# EAGLE design IIITDuino Ver0.5 (EAGLE 9.1.2)
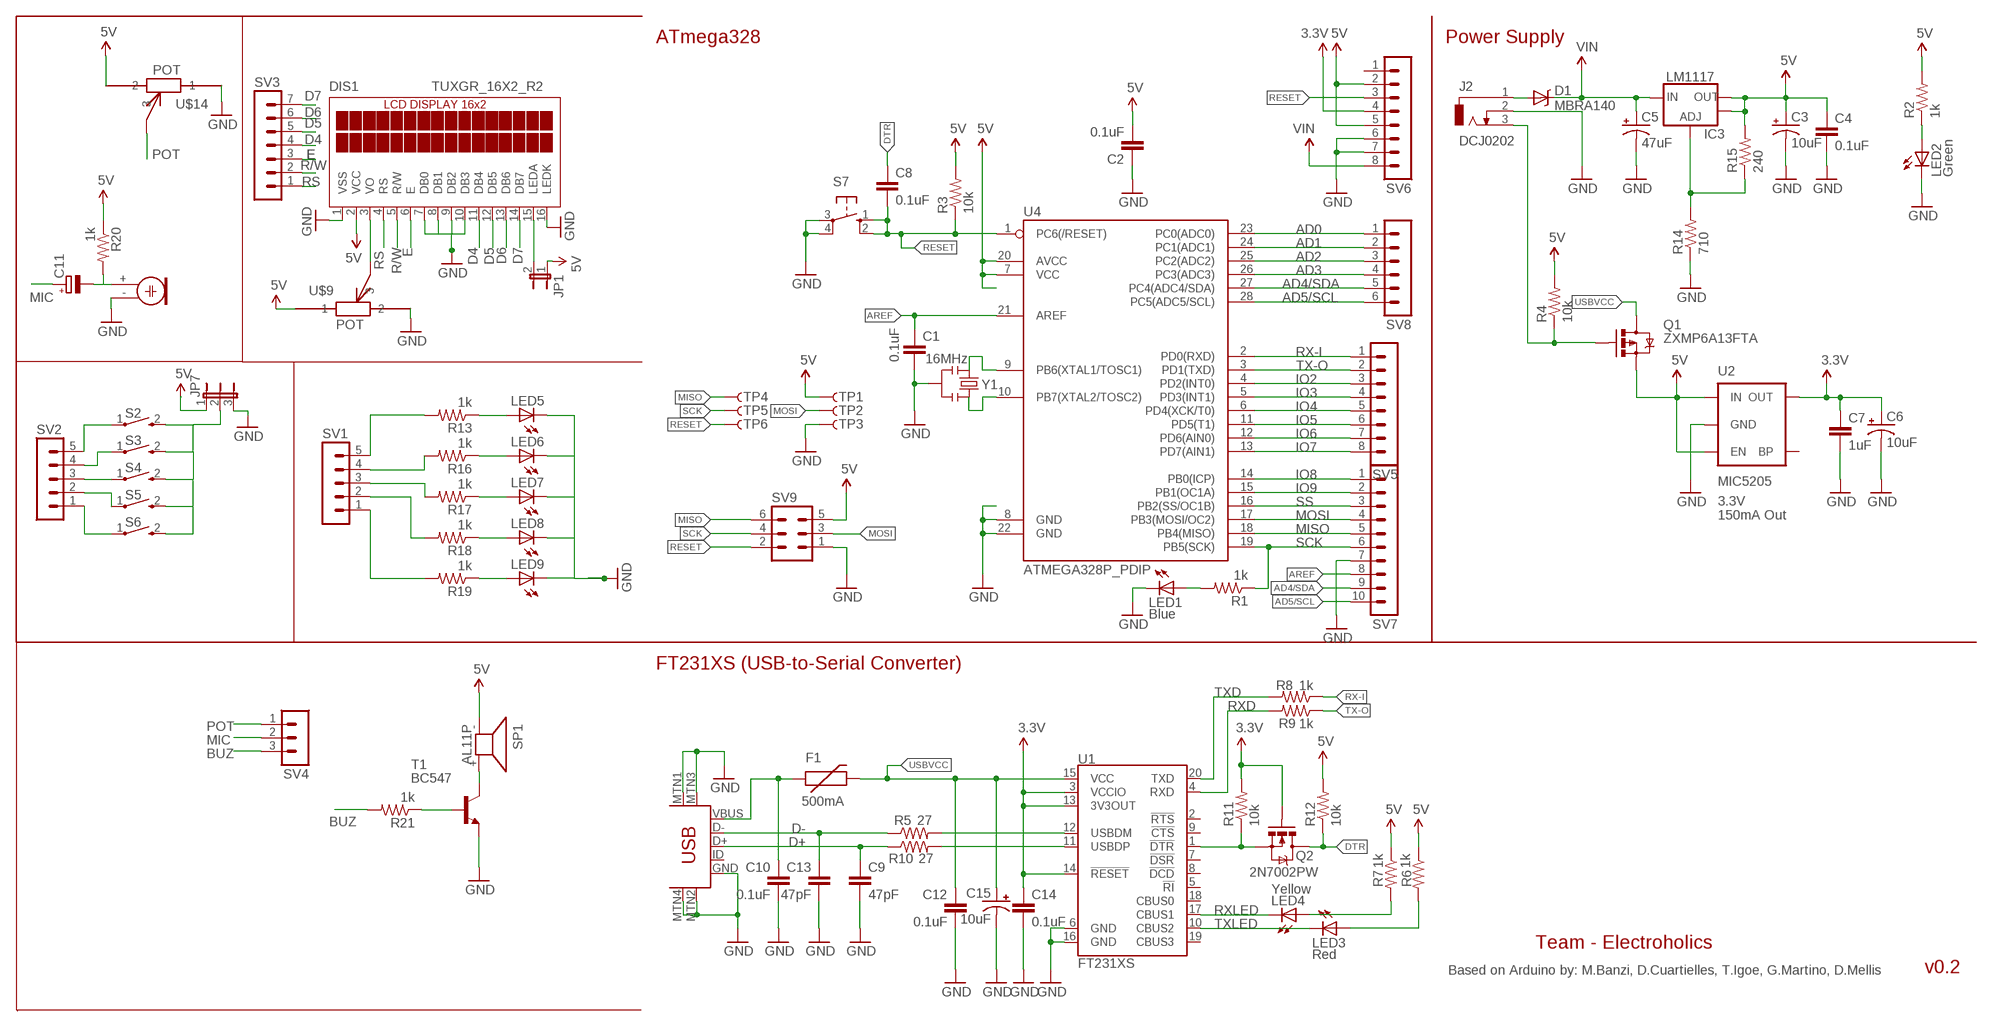
[diagram p0: schematic, sheet 1]

## Parts
C1  0.1uF  CAP0603-CAP  [0603-CAP]
C2  0.1uF  CAP0603-CAP  [0603-CAP]
C3  10uF  CAP_POL1206  [EIA3216]
C4  0.1uF  CAP0603-CAP  [0603-CAP]
C5  47uF  CAP_POLD  [PANASONIC_D]
C6  10uF  CAP_POL1206  [EIA3216]
C7  1uF  CAP0603-CAP  [0603-CAP]
C8  0.1uF  CAP0603-CAP  [0603-CAP]
C9  47pF  47PF-50V-5%(0603)  [0603-CAP]
C10  0.1uF  CAP0603-CAP  [0603-CAP]
C11  CPOL-EUE2.5-5  [E2,5-5]
C12  0.1uF  CAP0603-CAP  [0603-CAP]
C13  47pF  47PF-50V-5%(0603)  [0603-CAP]
C14  0.1uF  CAP0603-CAP  [0603-CAP]
C15  10uF  CAP_POL1206  [EIA3216]
D1  MBRA140  DIODE-SCHOTTKY_  [SMA-DIODE]
DIS1  TUXGR_16X2_R2  [LCD_16X2_PAC]
F1  500mA  PTCSMD  [PTC-1206]
IC3  LM1117  V_REG_LM1117ALT1  [SOT223-ALT1]
J2  DCJ0202  [DCJ0202]
JP1  JP1E  [JP1]
JP7  JP2E  [JP2]
LED1  Blue  LED1206-NS  [LED-1206-NO_SILK]
LED2  Green  LED1206-NS  [LED-1206-NO_SILK]
LED3  Red  LED1206-NS  [LED-1206-NO_SILK]
LED4  Yellow  LED1206-NS  [LED-1206-NO_SILK]
LED5  LEDCHIP-LED0805  [CHIP-LED0805]
LED6  LEDCHIP-LED0805  [CHIP-LED0805]
LED7  LEDCHIP-LED0805  [CHIP-LED0805]
LED8  LEDCHIP-LED0805  [CHIP-LED0805]
LED9  LEDCHIP-LED0805  [CHIP-LED0805]
M1  ELECTRET_MICROPHON-TOM-1545P-R  [TOM-1545P-R]
Q1  ZXMP6A13FTA  MOSFET-PCHANNELSMD  [SOT23-3]
Q2  2N7002PW  MOSFET-NCHANNEL2N7002PW  [SOT323]
R1  1k  RESISTOR0603-RES  [0603-RES]
R2  1k  RESISTOR0603-RES  [0603-RES]
R3  10k  RESISTOR0603-RES  [0603-RES]
R4  10k  RESISTOR0603-RES  [0603-RES]
R5  27  RESISTOR0603-RES  [0603-RES]
R6  1k  RESISTOR0603-RES  [0603-RES]
R7  1k  RESISTOR0603-RES  [0603-RES]
R8  1k  RESISTOR0603-RES  [0603-RES]
R9  1k  RESISTOR0603-RES  [0603-RES]
R10  27  RESISTOR0603-RES  [0603-RES]
R11  10k  RESISTOR0603-RES  [0603-RES]
R12  10k  RESISTOR0603-RES  [0603-RES]
R13  1k  RESISTOR0603-RES  [0603-RES]
R14  710  RESISTOR0603-RES  [0603-RES]
R15  240  RESISTOR0603-RES  [0603-RES]
R16  1k  RESISTOR0603-RES  [0603-RES]
R17  1k  RESISTOR0603-RES  [0603-RES]
R18  1k  RESISTOR0603-RES  [0603-RES]
R19  1k  RESISTOR0603-RES  [0603-RES]
R20  1k  RESISTOR0603-RES  [0603-RES]
R21  1k  RESISTOR0603-RES  [0603-RES]
S2  10-XX  [B3F-10XX]
S3  10-XX  [B3F-10XX]
S4  10-XX  [B3F-10XX]
S5  10-XX  [B3F-10XX]
S6  10-XX  [B3F-10XX]
S7  10-XX  [B3F-10XX]
SP1  AL11P  [AL11P]
SV1  MA05-1  [MA05-1]
SV2  MA05-1  [MA05-1]
SV3  MA07-1  [MA07-1]
SV4  MA03-1  [MA03-1]
SV5  MA08-1  [MA08-1]
SV6  MA08-1  [MA08-1]
SV7  MA10-1  [MA10-1]
SV8  MA06-1  [MA06-1]
SV9  MA03-2  [MA03-2]
T1  BC547  [TO92]
TP1  TP-3x5  TEST-POINT3X5  [PAD.03X.05]
TP2  TP-3x5  TEST-POINT3X5  [PAD.03X.05]
TP3  TP-3x5  TEST-POINT3X5  [PAD.03X.05]
TP4  TP-3x5  TEST-POINT3X5  [PAD.03X.05]
TP5  TP-3x5  TEST-POINT3X5  [PAD.03X.05]
TP6  TP-3x5  TEST-POINT3X5  [PAD.03X.05]
U1  FT231XS  [SSOP20_L]
U2  MIC5205  V_REG_LDOSMD  [SOT23-5]
U4  ATMEGA328P_PDIP  [DIL28-3]
U$9  POT  [CA9V]
U$13  USB-MINIB-5PIN  [USB-MINIB]
U$14  POT  [CA9V]
Y1  16MHz  RESONATORSMD  [RESONATOR-SMD]

## Nets
3.3V: C6.A(+) C7.1 C14.1 Q2.1(G) R11.2 SV6.4 U1.3(VCCIO) U1.13(3V3OUT) U1.14(!RESET) U2.5(OUT)
5V: C2.2 C3.A(+) C4.1 DIS1.2(VCC) IC3.2(OUT) IC3.4(OUT) JP1.1 Q1.2(S) R2.2 R3.2 R4.2 R6.1 R7.1 R12.2 R15.2 R20.1 SP1.- SV6.2 SV6.5 SV9.5 TP1.P$1 U2.1(IN) U2.3(EN) U4.7(VCC) U4.20(AVCC) U$9.A U$14.K
AD0: SV8.1 U4.23(PC0(ADC0))
AD1: SV8.2 U4.24(PC1(ADC1))
AD2: SV8.3 U4.25(PC2(ADC2))
AD3: SV8.4 U4.26(PC3(ADC3))
AD4/SDA: SV7.9 SV8.5 U4.27(PC4(ADC4/SDA))
AD5/SCL: SV7.10 SV8.6 U4.28(PC5(ADC5/SCL))
AREF: C1.1 SV7.8 U4.21(AREF)
BUZ: R21.2 SV4.3
D4: DIS1.11(DB4) SV3.4
D5: DIS1.12(DB5) SV3.5
D6: DIS1.13(DB6) SV3.6
D7: DIS1.14(DB7) SV3.7
D+: C9.1 R10.1 U$13.D+
D-: C13.1 R5.1 U$13.D-
DTR: C8.1 Q2.3(D) R12.1
E: DIS1.6(E) SV3.3
GND: C1.2 C2.1 C3.C(-) C4.2 C5.- C6.C(-) C7.2 C9.2 C10.2 C12.2 C13.2 C14.2 C15.C(-) DIS1.1(VSS) DIS1.7(DB0) DIS1.8(DB1) DIS1.9(DB2) DIS1.10(DB3) DIS1.16(LEDK) J2.2 LED1.C LED2.C LED5.C LED6.C LED7.C LED8.C LED9.C M1.- R14.1 S7.3(P) S7.4(P1) SV6.6 SV6.7 SV7.7 SV9.1 T1.1(E) TP3.P$1 U1.6(GND) U1.16(GND) U2.2(GND) U4.8(GND) U4.22(GND) U$9.K U$13.GND U$13.MTN1(MTN2) U$13.MTN2(MTN3) U$13.MTN3(MTN1) U$13.MTN4 U$14.A Y1.2
INSERT: J2.3 Q1.1(G) R4.1
IO2: SV5.3 U4.4(PD2(INT0))
IO3: SV5.4 U4.5(PD3(INT1))
IO4: SV5.5 U4.6(PD4(XCK/T0))
IO5: SV5.6 U4.11(PD5(T1))
IO6: SV5.7 U4.12(PD6(AIN0))
IO7: SV5.8 U4.13(PD7(AIN1))
IO8: SV7.1 U4.14(PB0(ICP))
IO9: SV7.2 U4.15(PB1(OC1A))
MIC: C11.+ SV4.2
MISO: SV7.5 SV9.6 TP4.P$1 U4.18(PB4(MISO))
MOSI: SV7.4 SV9.3 TP2.P$1 U4.17(PB3(MOSI/OC2))
N$1: LED1.A R1.2
N$2: LED2.A R2.1
N$3: U4.9(PB6(XTAL1/TOSC1)) Y1.1
N$4: U4.10(PB7(XTAL2/TOSC2)) Y1.3
N$5: DIS1.3(VO) U$9.S
N$6: R5.2 U1.12(USBDM)
N$7: R10.2 U1.11(USBDP)
N$8: LED3.A R6.2
N$10: LED4.A R7.2
N$12: Q2.2(S) R11.1 U1.1(!DTR)
N$15: IC3.1(ADJ) R14.2 R15.1
N$19: DIS1.15(LEDA) JP1.2
N$20: S2.1(P) SV2.5
N$21: LED5.A R13.1
N$22: LED6.A R16.1
N$23: LED7.A R17.1
N$24: LED8.A R18.1
N$25: LED9.A R19.1
N$26: R13.2 SV1.5
N$27: R16.2 SV1.4
N$28: R17.2 SV1.3
N$29: R18.2 SV1.2
N$30: R19.2 SV1.1
N$32: S3.1(P) SV2.4
N$33: S4.1(P) SV2.3
N$34: S5.1(P) SV2.2
N$35: S6.1(P) SV2.1
N$36: JP7.2 S2.2(S) S3.2(S) S4.2(S) S5.2(S) S6.2(S)
N$37: JP7.1
N$38: JP7.3
N$39: SP1.+ T1.3(C)
N$41: C11.- M1.+ R20.2
N$42: R21.1 T1.2(B)
POT: SV4.1 U$14.S
PWRIN: D1.A J2.1
R/W: DIS1.5(R/W) SV3.2
RESET: C8.2 R3.1 S7.1(S) S7.2(S1) SV6.3 SV9.2 TP6.P$1 U4.1(PC6(/RESET))
RS: DIS1.4(RS) SV3.1
RX-I: R8.1 SV5.1 U4.2(PD0(RXD))
RXD: R9.2 U1.4(RXD)
RXLED: LED4.C U1.17(CBUS1)
SCK: R1.1 SV7.6 SV9.4 TP5.P$1 U4.19(PB5(SCK))
SS: SV7.3 U4.16(PB2(SS/OC1B))
TX-O: R9.1 SV5.2 U4.3(PD1(TXD))
TXD: R8.2 U1.20(TXD)
TXLED: LED3.C U1.10(CBUS2)
USBVCC: C12.1 C15.A(+) F1.2 Q1.3(D) U1.15(VCC)
VIN: C5.+ D1.C IC3.3(IN) SV6.8
VUSB: C10.1 F1.1 U$13.VBUS
Unconnected: SV6.1 U1.2(!RTS) U1.5(!RI) U1.7(!DSR) U1.8(!DCD) U1.9(!CTS) U1.18(CBUS0) U1.19(CBUS3) U2.4(BP) U$13.ID

## Notes on the sheet
- ATmega328 | Power Supply
- 3.3V
  150mA Out
- FT231XS (USB-to-Serial Converter)
- Team - Electroholics
- Based on Arduino by: M.Banzi, D.Cuartielles, T.Igoe, G.Martino, D.Mellis | v0.2

## Library data of the parts
C1 C2 C4 C7 C8 C10 C12 C14 = SparkFun:CAP: Capacitor Standard 0603 ceramic capacitor, and 0.1" leaded capacitor.
C3 C5 C6 = SparkFun:CAP_POL: Capacitor Polarized These are standard SMD and PTH capacitors. Normally 10uF, 47uF, and 100uF in electrolytic and tantalum varieties. Always verify the external diameter of the through hole cap, it varies with capacity, voltage, and manufacturer. The EIA devices should be standard.
C9 C13 = SparkFun-Capacitors:47PF-50V-5%(0603): CAP-08913; PROD_ID: CAP-08913
C11 = rcl:CPOL-EU: POLARIZED CAPACITOR, European symbol
C15 = SparkFun-Capacitors:CAP_POL: Capacitor Polarized These are standard SMD and PTH capacitors. Normally 10uF, 47uF, and 100uF in electrolytic and tantalum varieties. Always verify the external diameter of the through hole cap, it varies with capacity, voltage, and manufacturer. The EIA devices should be standard.
D1 = SparkFun:DIODE-SCHOTTKY
DIS1 = lcd_16X2:TUXGR_16X2_R2: Tuxgraphics LCD display 16x2 characters reflective, without background light Source: tuxgr_12x2_r2.pdf
F1 = SparkFun:PTC: Resettable Fuse PTC Resettable Fuse. Spark Fun Electronics SKU : COM-08357
IC3 = Testing:V_REG_LM1117: Voltage Regulator LM1117 Standard adjustable voltage regulator but in SMD form. Spark Fun Electronics SKU : COM-00595
J2 = dc-jack:DCJ0202: DC POWER JACK Source: DCJ0202.pdf
JP1 = jumper:JP1E: JUMPER
JP7 = jumper:JP2E: JUMPER
LED1-LED4 = SparkFun-LED:LED: LEDs Standard schematic elements and footprints for 5mm, 3mm, 1206, and 0603 sized LEDs. 5mm - Spark Fun Electronics SKU : COM-00529 (and others)
LED5-LED9 = led:LED: LED OSRAM: - CHIPLED LG R971, LG N971, LY N971, LG Q971, LY Q971, LO R971, LY R971 LH N974, LH R974 LS Q976, LO Q976, LY Q976 LO Q996 - Hyper CHIPLED LW Q18S LB Q993, LB Q99A, LB R99A - SideLED LS A670, LO A670, LY A670, LG A670, LP A670 LB A673, LV A673, LT A673, LW A673 LH A674 LY A675 LS A676, LA A676, LO A676, LY A676, LW A676 LS A679, LY A679, LG A679 - Hyper Micro SIDELED® LS Y876, LA Y876, LO Y876, LY Y876 LT Y87S - SmartLED LW L88C, LW L88S LB L89C, LB L89S, LG L890 LS L89K, LO L89K, LY L89K LS L896, LA L896, LO L896, LY L896 - TOPLED LS T670, LO T670, LY T670, LG T670, LP T670 LSG T670, LSP T670, LSY T670, LOP T670, LYG T670 LG T671, LOG T671, LSG T671 LB T673, LV T673, LT T673, LW T673 LH T674 LS T676, LA T676, LO T676, LY T676, LB T676, LH T676, LSB T676, LW T676 LB T67C, LV T67C, LT T67C, LS T67K, LO T67K, LY T67K, LW E67C LS E67B, LA E67B, LO E67B, LY E67B, LB E67C, LV E67C, LT E67C LW T67C LS T679, LY T679, LG T679 LS T770, LO T770, LY T770, LG T770, LP T770 LB T773, LV T773, LT T773, LW T773 LH T774 LS E675, LA E675, LY E675, LS T675 LS T776, LA T776, LO T776, LY T776, LB T776 LHGB T686 LT T68C, LB T68C - Hyper Mini TOPLED® LB M676 - Mini TOPLED Santana® LG M470 LS M47K, LO M47K, LY M47K Source: http://www.osram.convergy.de LUXEON: - LUMILED® LXK2-PW12-R00, LXK2-PW12-S00, LXK2-PW14-U00, LXK2-PW14-V00 LXK2-PM12-R00, LXK2-PM12-S00, LXK2-PM14-U00 LXK2-PE12-Q00, LXK2-PE12-R00, LXK2-PE12-S00, LXK2-PE14-T00, LXK2-PE14-U00 LXK2-PB12-K00, LXK2-PB12-L00, LXK2-PB12-M00, LXK2-PB14-N00, LXK2-PB14-P00, LXK2-PB14-Q00 LXK2-PR12-L00, LXK2-PR12-M00, LXK2-PR14-Q00, LXK2-PR14-R00 LXK2-PD12-Q00, LXK2-PD12-R00, LXK2-PD12-S00 LXK2-PH12-R00, LXK2-PH12-S00 LXK2-PL12-P00, LXK2-PL12-Q00, LXK2-PL12-R00 Source: www.luxeon.com KINGBRIGHT: KA-3528ASYC Source: www.kingbright.com
M1 = microphon:ELECTRET_MICROPHON-: Electret Condenser Microphone
Q1 = SparkFun:MOSFET-PCHANNEL
Q2 = SparkFun-DiscreteSemi:MOSFET-NCHANNEL: Common NMOSFET Parts MFG P/N Store ID Prod ID FDD8780 TRANS-09984 SI7820DN TRANS-11055 FDS6630A IC-08089 2N7002PW TRANS-11151 FQP30N06L COM-10213 TRANS-10060 BSS123LT1G TRANS-08345 BSS138 TRANS-00830 BS170 2N7000; PROD_ID: TRANS-11151
R1-R4 R6-R9 R11-R21 = SparkFun:RESISTOR: Resistor Basic schematic elements and footprints for 0603, 1206, and PTH resistors.
R5 R10 = SparkFun-Resistors:RESISTOR: Resistor Basic schematic elements and footprints for 0603, 1206, and PTH resistors.
S2-S6 = switch:10-XX: OMRON SWITCH
S7 = switch-omron:10-XX: OMRON SWITCH; MPN: B3F-1000; OC_FARNELL: 176432; OC_NEWARK: 36M3542
SP1 = buzzer:AL11P: SPEAKER Source: Buerklin; OC_FARNELL: unknown; OC_NEWARK: unknown
SV1 SV2 = con-lstb:MA05-1: PIN HEADER; OC_FARNELL: unknown; OC_NEWARK: unknown
SV3 = con-lstb:MA07-1: PIN HEADER; OC_FARNELL: unknown; OC_NEWARK: unknown
SV4 = con-lstb:MA03-1: PIN HEADER; OC_FARNELL: unknown; OC_NEWARK: unknown
SV5 SV6 = con-lstb:MA08-1: PIN HEADER; OC_FARNELL: unknown; OC_NEWARK: unknown
SV7 = con-lstb:MA10-1: PIN HEADER; OC_FARNELL: unknown; OC_NEWARK: unknown
SV8 = con-lstb:MA06-1: PIN HEADER; OC_FARNELL: unknown; OC_NEWARK: unknown
SV9 = con-lstb:MA03-2: PIN HEADER; OC_FARNELL: unknown; OC_NEWARK: unknown
T1 = transistor:BC547: NPN TRANSISTOR
TP1-TP6 = SparkFun-Passives:TEST-POINT: Bare copper test points for troubleshooting or ICT
U1 = SparkFun-DigitalIC:FT231X: FTDI FT231X Full Speed USB to Full-handshake UART This USB2.0 Full Speed IC offers a compact bridge to full handshake UART interfaces. The device is a UART, capable of operating up to 3MBaud, with low power consumption (8mA). The FT231X includes the complete FT-X series feature set and enables USB to be added into a system design quickly and easily over a UART interface.
U2 = SparkFun:V_REG_LDO: Voltage Regulator LDO Standard 150mA LDO voltage regulator in SOT-23 layout. Micrel part MIC5205. BP (by-pass) pin is used to lower output noise with 470pF cap.
U4 = SparkFun-DigitalIC:ATMEGA328P_PDIP: uC used in the Arduino 32kb flash, 1k EEPROM, 2k SRAM This is the through-hole version of this chip.
U$9 U$14 = potentiometer:POT
U$13 = SparkFun-Connectors:USB-MINIB: Mini-USB "B" connector with 5th pin broken out. Created new symbol breaking out 5th "ID" pin in mini/micro USB connector spec. See: http://en.wikipedia.org/wiki/Mini_usb#Cables. Uses same footprint as 4-pin symbol. Also added pins to connect to mounting / shield pads if required (probably not generally needed as signals aren't shielded once they leave the connector).
Y1 = SparkFun-FreqCtrl:RESONATOR: Resonator Small SMD resonator. This is the itty bitty 10/20MHz resonators with built in caps. CSTCE10M0G55 and CSTCE20M0V53. Footprint has been reviewed closely but hasn't been tested yet.

## Net classes
0 default: width 0.381 mm, drill 0.305 mm, clearance 0.254 mm

## Board
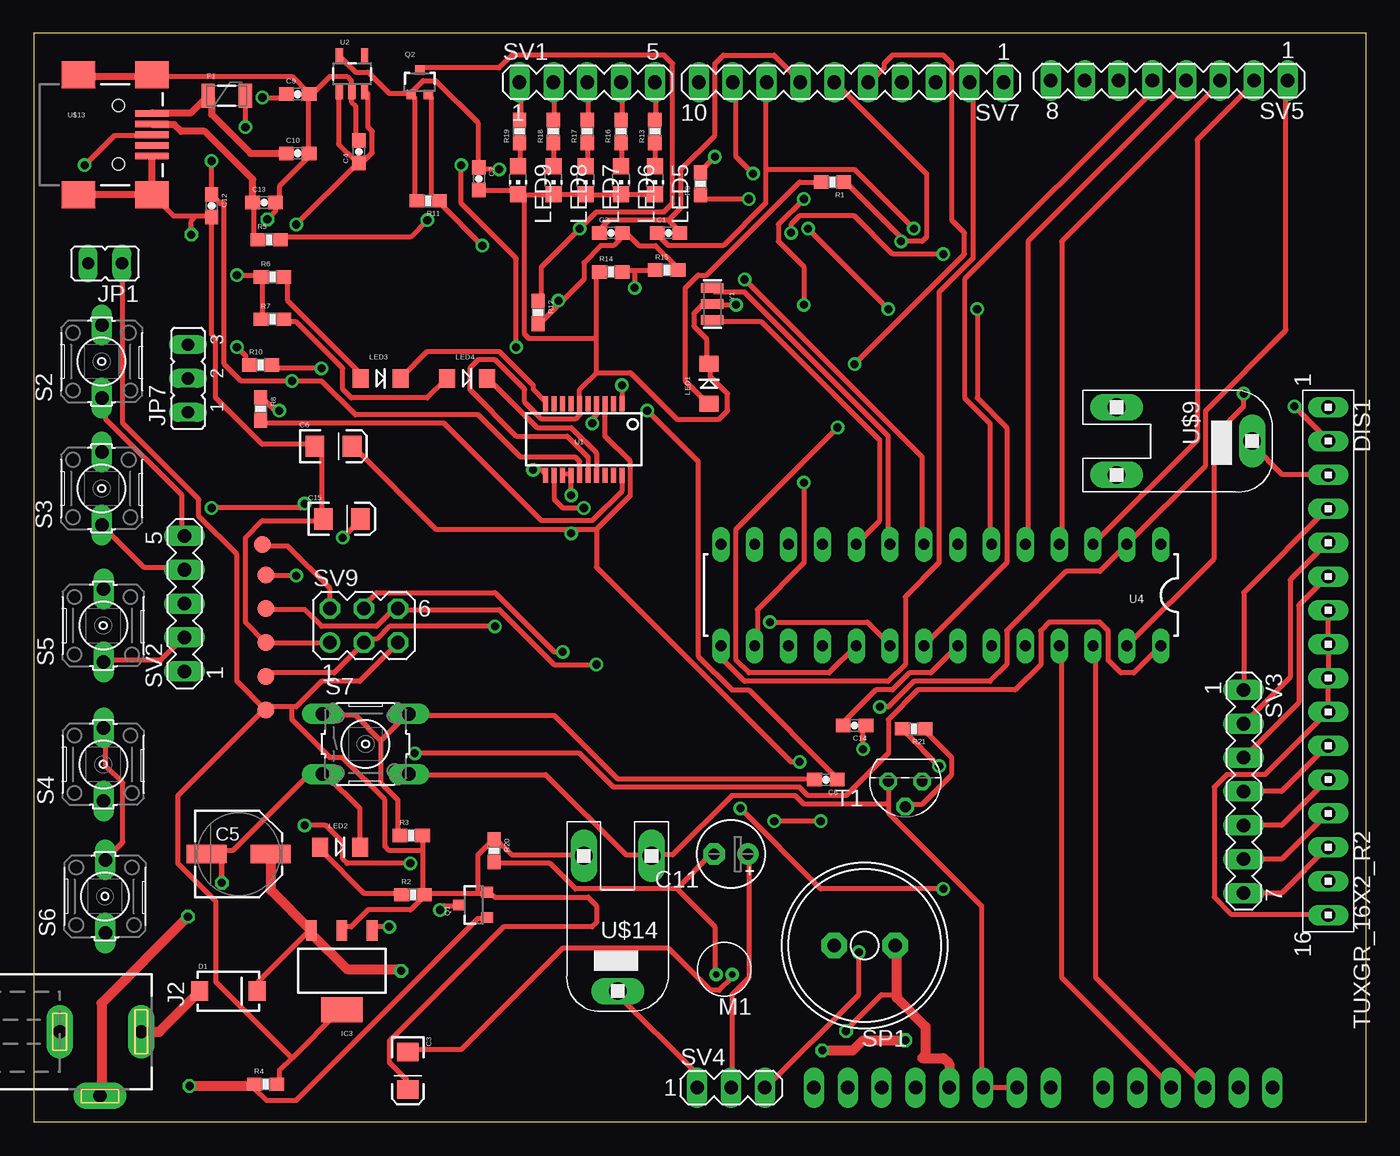
[diagram p1: board, top side]
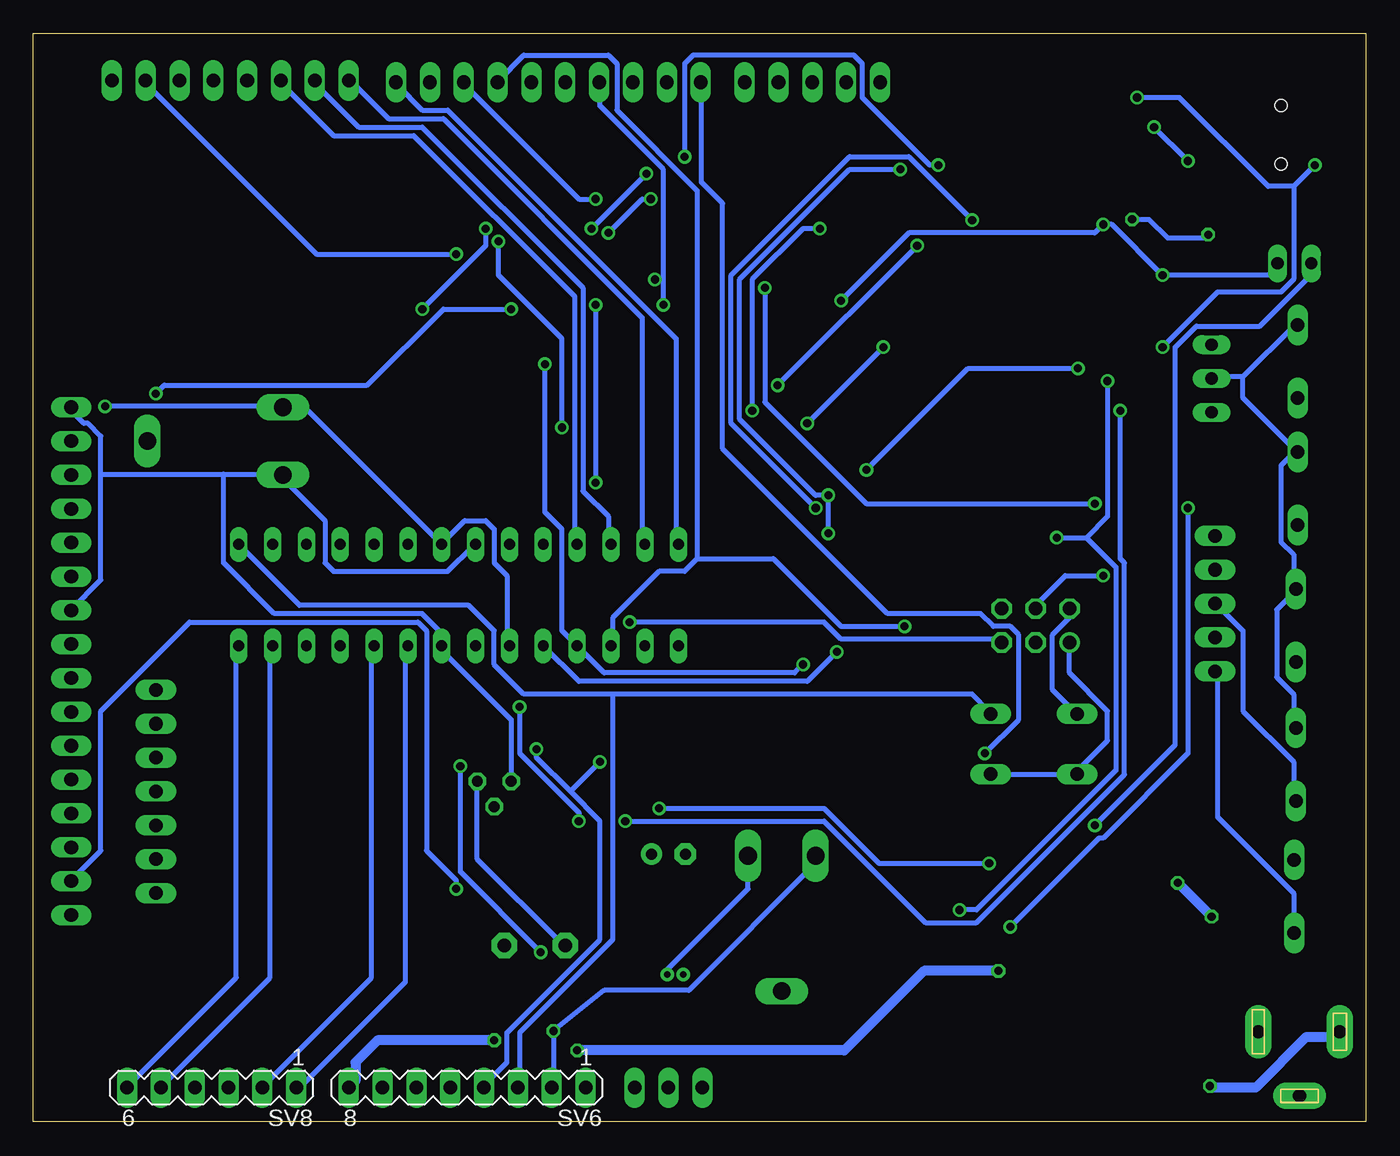
[diagram p2: board, bottom side, seen from below]

Size 100 x 81.65 mm. Coordinates in mm from the lower left corner, seen from the top.
Outline: 0,0 100,0 100,81.65 0,81.65 0,0
Copper layers (1*16): Top 0.035mm / dielectric 1.5mm / Bottom 0.035mm
Design rules "default *": minimum track width 10mil, minimum drill 24mil, track to track 8mil, track to pad 8mil, pad to pad 8mil, via to via 8mil, smd to smd 8mil, copper to edge 40mil, drill to drill 8mil, minimum pad ring 10mil, minimum via ring 8mil, stop-mask expansion 4mil, vias tented up to drill 0mil, thermal gap 10mil

### Footprints (pad centres in the part's own frame; a part is rotated, then mirrored left to right if it is on the bottom)
0603-CAP = smd 1.1 x 1: 1 -0.85,0; 2 0.85,0
EIA3216 = smd 1.4 x 1.6: A 1.4,0; C -1.4,0
PANASONIC_D = smd 3 x 1.4: + 2.4,0; - -2.4,0
E2,5-5 = drill 0.813 pad 1.6: + -1.27,0 | drill 0.813 pad 1.6 octagon: - 1.27,0
SMA-DIODE = smd 1.27 x 1.47: A -2.15,0; C 2.15,0
LCD_16X2_PAC = drill 1.016 pad 1.422 long: 1 -21.59,0; 2 -19.05,0; 3 -16.51,0; 4 -13.97,0; 5 -11.43,0; 6 -8.89,0; 7 -6.35,0; 8 -3.81,0; 9 -1.27,0; 10 1.27,0; 11 3.81,0; 12 6.35,0; 13 8.89,0; 14 11.43,0; 15 13.97,0; 16 16.51,0
PTC-1206 = smd 1 x 1.8: 1 -1.4,0; 2 1.4,0
SOT223-ALT1 = smd 0.813 x 1.524: 1 -2.271,-3.02; 2 0,-3.02; 3 2.288,-3.02 | smd 3.124 x 1.905: 4 0,2.921
DCJ0202 = drill 1 pad 2 long: 1 0,3.1; 2 4.8,0; 3 0,-3
JP1 = drill 0.914 long: 1 0,-1.27; 2 0,1.27
JP2 = drill 0.914 long: 1 -2.54,0; 2 0,0; 3 2.54,0
LED-1206-NO_SILK = smd 1.2 x 1.4: A -1.5,0; C 1.5,0
CHIP-LED0805 = smd 1.2 x 1.2: A 0,-1.05; C 0,1.05
TOM-1545P-R = drill 0.5 pad 0.8: + 0.6,0.4; - -0.6,0.4
SOT23-3 = smd 0.8 x 0.9: 1 -0.95,-1; 2 0.95,-1; 3 0,1.1
SOT323 = smd 0.7 x 0.7: 1 -0.65,-0.925; 2 0.65,-0.925; 3 0,0.925
0603-RES = smd 1.1 x 1: 1 -0.85,0; 2 0.85,0
B3F-10XX = drill 1.016 long: 1 -2.743,-0.025; 2 2.743,-0.025
B3F-10XX' = drill 1.016 long: 1 -3.251,2.261; 2 3.251,2.261; 3 -3.251,-2.261; 4 3.251,-2.261
AL11P = drill 1.016 pad 1.905 octagon: + 2.286,0; - -2.286,0
MA05-1 = drill 1.016 long: 1 -5.08,0; 2 -2.54,0; 3 0,0; 4 2.54,0; 5 5.08,0
MA07-1 = drill 1.016 long: 1 -7.62,0; 2 -5.08,0; 3 -2.54,0; 4 0,0; 5 2.54,0; 6 5.08,0; 7 7.62,0
MA03-1 = drill 1.016 long: 1 -2.54,0; 2 0,0; 3 2.54,0
MA08-1 = drill 1.016 long: 1 -8.89,0; 2 -6.35,0; 3 -3.81,0; 4 -1.27,0; 5 1.27,0; 6 3.81,0; 7 6.35,0; 8 8.89,0
MA10-1 = drill 1.016 long: 1 -11.43,0; 2 -8.89,0; 3 -6.35,0; 4 -3.81,0; 5 -1.27,0; 6 1.27,0; 7 3.81,0; 8 6.35,0; 9 8.89,0; 10 11.43,0
MA06-1 = drill 1.016 long: 1 -6.35,0; 2 -3.81,0; 3 -1.27,0; 4 1.27,0; 5 3.81,0; 6 6.35,0
MA03-2 = drill 1.016: 1 -2.54,-1.27 | drill 1.016 octagon: 2 -2.54,1.27; 3 0,-1.27; 4 0,1.27; 5 2.54,-1.27; 6 2.54,1.27
TO92 = drill 0.813 octagon: 1 1.27,0; 2 0,1.905; 3 -1.27,0
PAD.03X.05 = smd 1.27 x 1.27: P$1 0,0
SSOP20_L = smd 0.381 x 1.143: 1 -2.857,-2.68; 2 -2.223,-2.68; 3 -1.587,-2.68; 4 -0.953,-2.68; 5 -0.318,-2.68; 6 0.318,-2.68; 7 0.953,-2.68; 8 1.587,-2.68; 9 2.223,-2.68; 10 2.857,-2.68; 11 2.857,2.68; 12 2.223,2.68; 13 1.587,2.68; 14 0.953,2.68; 15 0.318,2.68; 16 -0.318,2.68; 17 -0.953,2.68; 18 -1.587,2.68; 19 -2.223,2.68; 20 -2.857,2.68
SOT23-5 = smd 0.55 x 1.2: 1 -0.95,-1.3; 2 0,-1.3; 3 0.95,-1.3; 4 0.95,1.3; 5 -0.95,1.3
DIL28-3 = drill 0.813 long: 1 -16.51,-3.81; 2 -13.97,-3.81; 3 -11.43,-3.81; 4 -8.89,-3.81; 5 -6.35,-3.81; 6 -3.81,-3.81; 7 -1.27,-3.81; 8 1.27,-3.81; 9 3.81,-3.81; 10 6.35,-3.81; 11 8.89,-3.81; 12 11.43,-3.81; 13 13.97,-3.81; 14 16.51,-3.81; 15 16.51,3.81; 16 13.97,3.81; 17 11.43,3.81; 18 8.89,3.81; 19 6.35,3.81; 20 3.81,3.81; 21 1.27,3.81; 22 -1.27,3.81; 23 -3.81,3.81; 24 -6.35,3.81; 25 -8.89,3.81; 26 -11.43,3.81; 27 -13.97,3.81; 28 -16.51,3.81
CA9V = drill 1.321 long: A -2.54,-5.08; K 2.54,-5.08; S 0,5.08
USB-MINIB = smd 2.5 x 0.5: D+ 2.5,0; D- 2.5,0.8; GND 2.5,-1.6; ID 2.5,-0.8; VBUS 2.5,1.6 | smd 2.5 x 2: MTN1 -3,4.5; MTN2 2.5,4.5; MTN3 -3,-4.5; MTN4 2.5,-4.5 | hole 0.9: 0,2.2; 0,-2.2
RESONATOR-SMD = smd 0.7 x 1.7: 1 -1.2,0; 2 0,0; 3 1.2,0

### Placement (x,y rotation side)
C1  47.62,66.67 0 top
C2  43.31,66.67 0 top
C3  28.07,3.81 270 top
C4  24.38,72.77 90 top
C5  15.37,20.07 0 top
C6  22.48,50.67 0 top
C7  33.4,70.74 270 top
C8  59.44,25.65 180 top
C9  19.81,77.09 0 top
C10  19.81,72.64 0 top
C11  52.32,20.07 180 top
C12  13.34,68.71 270 top
C13  17.27,68.96 0 top
C14  61.59,29.72 180 top
C15  23.11,45.21 0 top
D1  14.61,9.78 0 top
DIS1  97.16,32 270 top
F1  14.48,76.96 0 top
IC3  23.11,11.3 180 top
J2  4.95,6.73 270 top
JP1  5.33,64.39 90 top
JP7  11.56,55.75 90 top
LED1  50.67,55.37 90 top
LED2  22.99,20.57 0 top
LED3  26.04,55.75 0 top
LED4  32.51,55.75 0 top
LED5  46.61,70.61 180 top
LED6  44.07,70.61 180 top
LED7  41.4,70.61 180 top
LED8  38.99,70.61 180 top
LED9  36.32,70.61 180 top
M1  51.82,11.43 180 top
Q1  33.02,16.26 90 top
Q2  28.96,77.98 0 top
R1  59.94,70.48 180 top
R2  28.45,17.02 0 top
R3  28.32,21.46 0 top
R4  17.4,2.79 0 top
R5  17.65,66.17 0 top
R6  17.91,63.37 0 top
R7  17.91,60.2 0 top
R8  17.02,53.47 270 top
R9  50.04,70.36 90 top
R10  17.02,56.77 0 top
R11  29.59,69.09 180 top
R12  37.85,60.71 270 top
R13  46.61,74.3 90 top
R14  43.31,63.75 0 top
R15  47.5,63.88 0 top
R16  44.07,74.3 90 top
R17  41.53,74.3 90 top
R18  38.99,74.3 90 top
R19  36.45,74.3 90 top
R20  34.54,20.32 270 top
R21  66.04,29.46 180 top
S2  5.08,57.02 90 top
S3  5.08,47.5 90 top
S4  5.21,26.8 90 top
S5  5.21,37.21 90 top
S6  5.33,16.89 90 top
S7  [B3F-10XX']  24.89,28.32 0 top
SP1  62.36,13.21 180 top
SV1  41.53,77.98 0 top
SV2  11.3,38.86 90 top
SV3  90.81,24.77 270 top
SV4  52.32,2.54 0 top
SV5  85.22,78.11 180 top
SV6  67.44,2.54 180 bottom
SV7  61.34,77.98 180 top
SV8  86.61,2.54 180 bottom
SV9  24.77,37.21 0 top
T1  65.41,25.53 180 top
TP1  17.4,30.86 0 top
TP2  17.4,33.4 0 top
TP3  17.4,35.94 0 top
TP4  17.4,38.48 0 top
TP5  17.4,41.02 0 top
TP6  17.14,43.31 0 top
U1  41.27,51.18 180 top
U2  23.88,78.61 0 top
U4  68.07,39.5 180 top
U$9  86.36,51.05 270 top
U$13  6.35,74.04 0 top
U$14  43.81,14.86 180 top
Y1  50.93,61.34 270 top

### Tracks (layer width: path | path; a pad name or v marks a point on that pad's centre or on a via)
3.3V  (via drill 0.61)
  Top 0.381: v62.23,27.94 62.23,29.53 C14.1 | 28.26,77.15 26.67,77.15 25.08,78.74 24.13,78.74 23.18,79.69 U2.5 | R11.2 28.57,69.22 28.57,76.83 Q2.1 28.26,77.15 | 28.26,77.15 29.21,78.11 30.16,78.11 33.34,74.93 33.34,71.75 C7.1 33.66,71.44 v34.92,71.44 | U1.13 39.69,48.58 40.32,48.58 U1.14 v40.32,46.99 | U1.3 42.86,51.44 44.77,49.53 44.77,46.99 42.23,44.45 | 40.32,44.45 30.16,44.45 24.13,50.48 C6.A | 40.32,44.45 42.23,44.45 | 40.32,44.45 v40.32,44.13 | v57.47,26.99 56.83,26.99 42.23,41.59 42.23,44.45
  Bottom 0.381: v62.23,27.94 62.23,27.3 59.69,24.77 | 59.69,24.77 57.47,22.54 57.47,13.65 64.45,6.67 64.45,4.45 66.36,2.54 SV6.4 | v40.32,44.13 v40.32,46.99 41.27,46.99 46.99,52.7 46.99,63.18 38.73,71.44 v34.92,71.44 | v57.47,26.99 59.69,24.77
5V  (via drill 0.61)
  Top 0.381: 39.69,61.59 41.27,63.18 41.27,64.45 42.55,65.72 43.5,65.72 44.45,66.67 | 39.69,61.59 38.1,60.01 R12.2 | 44.45,66.67 45.4,65.72 46.67,65.72 48.26,64.14 R15.2 | 44.45,66.67 C2.2 | C4.1 24.13,72.07 22.86,73.34 22.86,77.15 U2.1 | U2.3 25.08,77.15 25.08,74.61 25.4,74.3 25.4,72.71 24.45,71.75 C4.1 | R7.1 17.14,60.33 17.14,63.18 R6.1 16.83,63.5 v15.24,63.5 | v19.68,67.31 24.13,71.75 C4.1 | v39.37,61.59 39.69,61.59 | v94.61,53.66 97.16,51.12 DIS1.2 | 19.37,4.76 22.86,8.26 IC3.4 | 19.37,4.76 18.41,3.81 18.41,2.86 R4.2 | 19.37,31.11 19.68,31.11 21.59,33.02 24.45,33.02 27.3,35.88 SV9.5 | 19.37,31.11 17.46,31.11 TP1.P$1 | 19.37,4.76 13.65,10.48 13.65,16.51 10.79,19.37 10.79,24.45 17.14,30.8 TP1.P$1 | 33.34,17.14 29.53,17.14 R2.2 | 33.34,17.14 33.97,17.14 Q1.2 34.29,17.14 34.61,16.83 41.59,16.83 42.23,16.19 42.23,14.92 41.91,14.61 35.24,14.61 26.67,6.03 26.67,4.45 27.94,3.17 27.94,2.54 C3.A | 33.34,17.14 33.34,20 34.29,20.95 R20.1 34.61,21.27 35.88,20 41.27,20 U$14.K | 29.21,20.32 29.21,17.14 R2.2 | 29.21,20.32 29.21,21.27 R3.2 | IC3.2 23.18,14.61 23.81,14.61 25.08,15.88 28.26,15.88 29.21,16.83 R2.2 | 19.37,31.11 19.37,30.16 22.23,27.3 23.18,27.3 26.35,24.13 26.35,20.64 26.67,20.32 29.21,20.32 | v55.24,37.47 62.55,37.47 64.14,35.88 U4.20 | TP1.P$1 15.24,33.02 15.24,42.55 12.38,45.4 12.38,46.67 6.67,52.39 6.67,64.14 JP1.1 | v60.96,6.79 60.96,6.86 63.63,9.53 64.77,9.53
  Top 0.762: SV6.5 68.71,4.32 68.26,4.76 66.67,4.76 66.93,5.02 66.93,7.11 64.77,9.27 64.77,9.53 64.77,13.08 SP1.-
  Bottom 0.381: JP1.1 6.67,64.14 7.3,63.5 v15.24,63.5 19.05,67.31 v19.68,67.31 20.32,66.67 34.29,66.67 v39.37,61.59 | U4.20 64.45,35.88 64.45,40.96 65.41,41.91 65.41,44.45 66.04,45.09 67.63,45.09 69.22,43.5 U4.7 79.38,53.34 81.28,53.34 U$9.A 81.28,53.66 v94.61,53.66 | U$14.K 41.27,19.37 50.8,9.84 57.15,9.84 v60.96,6.79 60.96,2.54 SV6.2 | v55.24,37.47 40.64,37.47 39.37,36.2 27.3,36.2 SV9.5
AD0
  Bottom 0.381: U4.23 72.07,35.56 72.07,10.48 80.01,2.54 SV8.1
AD1
  Bottom 0.381: U4.24 74.61,35.56 74.61,10.79 82.87,2.54 SV8.2
AD2
  Top 0.381: U4.25 77.15,35.56 77.15,10.79 85.41,2.54 SV8.3
AD3
  Top 0.381: U4.26 79.69,35.56 79.69,10.79 87.95,2.54 SV8.4
AD4/SDA  (via drill 0.61)
  Top 0.381: v53.98,71.12 52.7,72.39 52.7,77.79 SV7.9 | v64.14,60.96 v58.1,66.99 | v90.81,54.61 90.81,53.66 88.58,51.44 88.58,42.23 U4.27
  Bottom 0.381: U4.27 82.23,35.56 82.23,10.79 90.49,2.54 SV8.5 | v58.1,66.99 v53.98,71.12 | v64.14,60.96 69.22,60.96 74.93,55.24 90.17,55.24 v90.81,54.61
AD5/SCL  (via drill 0.61)
  Top 0.381: v28.57,27.62 40.96,27.62 43.5,25.08 57.47,25.08 58.1,24.45 60.96,24.45 64.14,27.62 64.14,30.16 66.36,32.38 73.66,32.38 75.56,34.29 75.56,36.83 76.2,37.47 80.01,37.47 80.64,36.83 80.64,34.61 81.6,33.66 82.55,33.66 U4.28
  Bottom 0.381: U4.28 84.77,35.56 84.77,10.79 93.03,2.54 SV8.6 | v28.57,27.62 26.04,30.16 26.04,36.51 26.67,37.15 27.94,37.15 28.89,38.1 35.88,38.1 48.26,50.48 48.26,68.9 49.85,70.48 49.85,77.79 SV7.10
AREF  (via drill 0.61)
  Top 0.381: 54.93,71.44 54.93,77.79 SV7.8 | 54.93,71.44 54.93,68.9 51.75,65.72 47.62,65.72 46.99,66.36 46.99,66.67 C1.1 | U4.21 73.03,41.91 73.03,52.07 70.8,54.29 v70.8,60.96 | v66.04,66.99 61.59,71.44 54.93,71.44
  Bottom 0.381: v70.8,60.96 66.04,65.72 v66.04,66.99
BUZ  (via drill 0.61)
  Top 0.381: v67.94,26.67 65.41,29.21 R21.2 | v61.91,12.7 61.91,9.53 54.93,2.54 SV4.3
  Bottom 0.381: v67.94,26.67 67.94,18.73 v61.91,12.7
D4
  Top 0.381: SV3.4 93.66,24.77 97.16,28.26 DIS1.11
D5
  Top 0.381: SV3.5 93.66,22.23 97.16,25.72 DIS1.12
D6
  Top 0.381: SV3.6 93.66,19.68 97.16,23.18 DIS1.13
D7
  Top 0.381: SV3.7 93.66,17.14 97.16,20.64 DIS1.14
D+  (via drill 0.61)
  Top 0.381: v15.24,58.1 15.88,57.47 15.88,56.83 R10.1 | v3.81,71.75 6.03,73.98 8.57,73.98 U$13.D+ | v17.14,76.83 18.73,76.83 C9.1
  Bottom 0.381: v15.24,58.1 11.11,62.23 6.35,62.23 5.4,63.18 5.4,70.17 | v3.81,71.75 5.4,70.17 | v17.14,76.83 13.97,76.83 7.3,70.17 5.4,70.17
D-
  Top 0.381: R5.1 16.51,66.36 16.51,68.9 C13.1
  Top 0.508: C13.1 16.42,70.7 12.83,74.3 11.05,74.3 10.54,74.8 8.89,74.8 U$13.D-
DTR  (via drill 0.61)
  Top 0.381: Q2.3 29.21,79.06 34.92,79.06 35.88,80.01 47.31,80.01 47.94,79.38 47.94,68.9 47.31,68.26 42.23,68.26 v40.96,66.99 38.1,64.14 38.1,61.59 R12.1 | v46.04,53.34 49.85,49.53 49.85,34.92 52.39,32.38 53.66,32.38 60.01,26.04 60.01,25.72 C8.1
  Bottom 0.381: v46.04,53.34 46.04,63.18 42.23,66.99 v40.96,66.99
E
  Top 0.381: SV3.3 94.93,31.43 94.93,38.73 97.16,40.96 DIS1.6
GND  (via drill 0.61)
  Top 0.381: 47.62,67.63 43.18,67.63 42.55,66.99 42.55,66.67 C2.1 | 47.62,67.63 48.58,66.67 C1.2 | 47.62,67.63 48.58,68.58 48.58,71.44 51.12,73.98 51.12,79.38 51.75,80.01 55.56,80.01 57.47,78.11 SV7.7 | LED5.C 46.35,69.53 44.13,69.53 LED6.C 43.81,69.53 41.59,69.53 LED7.C 41.27,69.53 39.05,69.53 LED8.C 38.73,69.53 36.83,69.53 | C7.2 33.66,69.85 36.2,69.85 LED9.C | 36.83,69.53 36.51,69.53 LED9.C | 42.23,56.2 42.23,58.74 | 42.23,58.74 42.23,63.5 R14.1 | 42.23,56.2 40.96,54.93 U1.6 40.96,53.02 40.64,52.7 38.1,52.7 36.83,53.98 36.83,54.93 34.61,57.15 33.34,57.15 32.7,56.52 32.7,54.93 36.2,51.44 40.01,51.44 41.59,49.85 U1.16 | 42.23,56.2 44.77,56.2 48.26,52.7 51.44,52.7 52.07,53.34 52.07,54.61 50.8,55.88 50.8,56.83 LED1.C 50.48,57.15 50.48,58.74 49.53,59.69 49.53,60.64 50.16,61.28 50.8,61.28 Y1.2 51.12,61.28 v52.7,61.28 | 36.83,69.53 36.83,59.05 37.15,58.74 42.23,58.74 | 36.83,69.53 LED9.C | DIS1.7 DIS1.8 DIS1.9 97.16,30.8 | 97.16,30.8 92.39,26.04 89.53,26.04 88.58,25.08 88.58,16.83 89.85,15.56 97.16,15.56 DIS1.16 | 97.16,30.8 DIS1.10 | v53.34,63.18 66.67,49.85 66.67,43.5 U4.8 | C3.C 28.26,5.4 32.07,5.4 39.69,13.02 47.62,13.02 50.8,9.84 51.44,9.84 52.39,10.79 M1.- | SV6.7 SV6.6 71.12,2.54 71.12,16.19 64.14,23.18 64.14,23.81 | U4.22 67.31,33.66 65.72,33.66 64.45,32.38 63.18,32.38 60.96,30.16 60.96,29.84 C14.2 | T1.1 64.14,23.81 | 46.35,20 47.94,20 52.39,24.45 57.15,24.45 57.78,23.81 64.14,23.81 | C4.2 24.13,73.66 24.13,76.2 23.81,76.52 23.81,77.15 U2.2 23.81,77.47 23.81,78.11 23.5,78.42 22.23,78.42 20.95,77.15 C9.2 | C9.2 20.64,76.83 20.64,72.71 C10.2 20.64,72.39 18.41,70.17 18.41,69.22 C13.2 18.12,68.29 v17.53,67.69
  Top 0.381: 3.49,78.42 U$13.MTN1 3.17,78.42 | 8.57,78.42 U$13.MTN2 8.89,78.42 19.37,78.42 20.64,77.15 C9.2 | 12.19,67.94 10.48,67.94 8.89,69.53 U$13.MTN4 8.57,69.53 | 12.19,67.94 13.34,67.94 C12.2 13.34,59.05 13.65,58.74 13.65,54.29 17.14,50.8 20.95,50.8 C6.C 21.27,50.48 21.59,50.16 21.59,45.4 C15.C 21.59,45.09 17.14,45.09 15.88,43.81 15.88,37.47 TP3.P$1 17.46,35.88 22.23,35.88 SV9.1 | 3.49,69.53 U$13.MTN3 3.17,69.85 2.86,70.17 | LED2.C 24.45,20.64 24.45,23.5 21.91,26.04 S7.3 21.59,26.04 20.64,26.04 14.92,20.32 14.35,20.32 13.02,20.32 C5.- | 46.35,20 44.45,20 38.42,26.04 28.26,26.04 S7.4 | 46.35,20 U$14.A | v11.81,66.55 11.81,67.56 12.19,67.94
  Top 0.406: v14.1,17.91 14.1,20.07 14.35,20.32
  Top 0.508: U$13.GND U$13.MTN4 | 8.57,69.53 U$13.MTN3 | 3.49,78.42 8.73,78.42 U$13.MTN2
  Top 0.762: v11.56,15.37 5.08,8.89 5.08,2.06 J2.2
  Bottom 0.381: v52.7,61.28 52.7,63.18 | 52.7,63.18 52.7,71.44 57.47,76.2 57.47,77.79 SV7.7 | U4.8 66.99,43.18 68.9,41.27 77.47,41.27 78.11,41.91 78.11,45.09 81.28,48.26 U$9.K 81.28,48.58 85.72,48.58 | 94.93,48.58 94.93,40.64 97.16,38.42 DIS1.7 | 94.93,48.58 94.93,51.44 95.89,52.39 96.2,52.39 97.16,53.34 DIS1.1 | 94.93,48.58 85.72,48.58 | v53.34,63.18 52.7,63.18 | U$14.A 46.35,17.46 52.7,11.11 M1.- | T1.1 64.14,30.16 69.53,35.56 U4.22 69.53,35.88 69.53,36.83 70.8,38.1 81.92,38.1 85.72,41.91 85.72,48.58 | S7.4 27.94,26.04 21.91,26.04 S7.3 21.59,26.35 19.37,28.57 19.37,30.8 22.23,33.66 SV9.1 | v17.53,67.69 16.26,67.69 14.86,66.29 12.06,66.29 v11.81,66.55
  Bottom 0.762: v11.56,15.37 v14.1,17.91
INSERT  (via drill 0.61)
  Top 0.381: Q1.1 33.97,15.24 33.34,15.24 19.68,1.59 17.46,1.59 16.51,2.54 R4.1
  Top 0.762: v11.68,2.67 16.42,2.67 R4.1
  Bottom 0.762: v11.68,2.67 11.56,2.54 8.26,2.54 4.45,6.35 2.33,6.35 J2.3
IO2
  Top 0.381: U4.4 77.15,43.5 77.15,66.04 89.22,78.11 SV5.3
IO3
  Top 0.381: U4.5 74.61,43.5 74.61,66.04 86.68,78.11 SV5.4
IO4
  Top 0.381: U4.6 71.75,43.5 71.75,52.39 69.85,54.29 69.85,63.18 83.82,77.15 83.82,78.11 SV5.5
IO5
  Bottom 0.381: U4.11 59.37,43.5 59.37,61.91 71.44,73.98 77.47,73.98 81.6,78.11 SV5.6
IO6
  Bottom 0.381: U4.12 56.83,43.5 56.83,45.4 58.74,47.31 58.74,62.55 70.8,74.61 75.56,74.61 79.06,78.11 SV5.7
IO7
  Bottom 0.381: U4.13 54.29,43.5 54.29,60.33 69.22,75.25 73.34,75.25 76.2,78.11 SV5.8
IO8
  Bottom 0.381: U4.14 51.75,43.5 51.75,58.74 68.9,75.88 70.8,75.88 72.71,77.79 SV7.1
IO9
  Top 0.381: U4.15 51.75,35.56 51.75,34.61 53.34,33.02 64.14,33.02 65.41,34.29 65.41,39.37 67.94,41.91 67.94,62.23 70.48,64.77 70.48,77.79 SV7.2
MIC
  Top 0.381: SV4.2 52.39,2.54 52.39,9.53 53.66,10.79 53.66,20 C11.+
MISO  (via drill 0.61)
  Top 0.381: TP4.P$1 17.46,38.42 20.32,38.42 21.59,37.15 25.72,37.15 27.3,38.73 SV9.6 27.3,38.42 34.92,38.42 39.05,34.29 v42.23,34.29 | v61.59,56.83 69.85,65.09 69.85,66.67 68.9,67.63 68.9,79.38 68.26,80.01 64.45,80.01 63.82,79.38 63.82,79.06 62.87,78.11 SV7.5
  Bottom 0.381: v42.23,34.29 42.86,33.66 57.15,33.66 U4.18 60.33,36.83 60.33,44.45 61.59,45.72 v61.59,56.83
MOSI  (via drill 0.61)
  Top 0.381: TP2.P$1 17.46,33.66 22.54,33.66 24.77,35.88 SV9.3 24.77,36.2 25.72,36.2 26.67,37.15 v34.61,37.15
  Bottom 0.381: 50.16,42.23 51.12,41.27 53.02,41.27 56.52,37.78 56.52,35.88 U4.17 | 50.16,42.23 50.16,69.85 56.2,75.88 56.2,79.38 56.83,80.01 63.18,80.01 65.09,78.11 SV7.4 | v34.61,37.15 39.37,37.15 44.45,42.23 50.16,42.23
N$1
  Top 0.381: R1.2 57.47,70.48 50.48,63.5 49.85,63.5 48.9,62.55 48.9,55.56 50.48,53.98 LED1.A
N$2
  Top 0.381: R2.1 27.3,17.14 24.77,17.14 21.59,20.32 LED2.A
N$3
  Top 0.381: Y1.1 51.12,62.23 53.34,62.23 64.14,51.44 64.14,43.5 U4.9
N$4
  Top 0.381: U4.10 63.5,45.09 63.5,51.12 54.61,60.01 51.12,60.01 Y1.3
N$5
  Top 0.381: DIS1.3 97.16,48.58 93.66,48.58 91.44,50.8 U$9.S
N$6  (via drill 0.61)
  Top 0.381: v29.53,67.63 28.26,66.36 18.73,66.36 R5.2 | v41.27,46.04 39.69,46.04 39.05,46.67 U1.12
  Bottom 0.381: v29.53,67.63 34.29,72.39 38.73,72.39 47.62,63.5 47.62,52.39 v41.27,46.04
N$7  (via drill 0.61)
  Top 0.381: v21.59,56.52 18.1,56.52 R10.2 | v37.47,48.9 38.1,48.9 38.42,48.58 U1.11
  Bottom 0.381: v21.59,56.52 29.84,56.52 v37.47,48.9
N$8
  Top 0.381: R6.2 19.05,63.18 19.05,61.59 24.77,55.88 LED3.A
N$10
  Top 0.381: R7.2 19.05,60.01 19.68,60.01 23.18,56.52 23.18,54.93 23.81,54.29 29.53,54.29 30.8,55.56 LED4.A
N$12  (via drill 0.61)
  Top 0.381: Q2.2 29.84,76.83 29.84,69.53 30.16,69.22 R11.1 30.48,68.9 v33.66,65.72 | v44.13,55.24 U1.1
  Bottom 0.381: v33.66,65.72 v44.13,55.24
N$15  (via drill 0.61)
  Top 0.381: 45.09,63.82 46.35,63.82 R15.1 | 45.09,63.82 44.45,63.82 R14.2 | v26.67,14.61 25.4,14.61 IC3.1 | v13.34,46.04 20,46.04 v20.32,46.35 | 45.09,63.82 v45.09,62.55
  Bottom 0.381: v26.67,14.61 20,21.27 19.68,21.27 13.34,27.62 v13.34,46.04 | v20.32,46.35 37.47,46.35 45.09,53.98 v45.09,62.55
N$19  (via drill 0.61)
  Top 0.381: v20.32,22.23 21.91,22.23 23.18,20.95 23.18,19.68 23.5,19.37 v28.26,19.37 | v53.02,23.5 59.05,17.46 v68.26,17.46
  Bottom 0.381: v20.32,22.23 14.29,28.26 14.29,58.1 12.7,59.69 7.94,59.69 4.13,63.5 4.13,64.14 JP1.2 | v28.26,19.37 36.51,19.37 40.64,23.5 v53.02,23.5 | v68.26,17.46 68.26,18.1 70.48,20.32 70.48,36.83 71.12,37.47 88.27,37.47 94.93,30.8 94.93,20.32 97.16,18.1 DIS1.15
N$20
  Top 0.381: S2.1 5.4,53.98 5.4,52.7 11.11,46.99 11.11,44.13 SV2.5
N$21
  Top 0.381: R13.1 46.67,73.34 46.67,71.75 LED5.A
N$22
  Top 0.381: R16.1 44.13,73.34 44.13,71.75 LED6.A
N$23
  Top 0.381: R17.1 41.59,73.34 41.59,71.75 LED7.A
N$24
  Top 0.381: R18.1 39.05,73.34 39.05,71.75 LED8.A
N$25
  Top 0.381: R19.1 36.51,73.34 36.51,71.75 LED9.A
N$26
  Top 0.381: R13.2 46.67,75.25 46.67,77.79 SV1.5
N$27
  Top 0.381: R16.2 44.13,75.25 44.13,77.79 SV1.4
N$28
  Top 0.381: R17.2 41.59,75.25 41.59,77.79 SV1.3
N$29
  Top 0.381: R18.2 39.05,75.25 39.05,77.79 SV1.2
N$30
  Top 0.381: R19.2 36.51,75.25 36.51,77.79 SV1.1
N$32
  Top 0.381: SV2.4 11.11,41.59 8.26,41.59 5.4,44.45 S3.1
N$33
  Bottom 0.381: S4.1 5.4,24.13 5.4,26.99 9.21,30.8 9.21,36.83 11.11,38.73 SV2.3
N$34
  Top 0.381: S5.1 5.4,34.61 9.53,34.61 11.11,36.2 SV2.2
N$35
  Bottom 0.381: S6.1 5.4,14.29 5.4,17.14 11.11,22.86 11.11,33.66 SV2.1
N$36
  Top 0.381: S4.2 5.4,29.53 5.4,26.67 6.67,25.4 6.67,20.95 5.4,19.68 S6.2
  Bottom 0.381: 9.21,55.88 11.43,55.88 JP7.2 | 9.21,55.88 5.4,59.69 S2.2 | S4.2 5.4,29.84 5.4,32.07 6.67,33.34 6.67,38.42 5.4,39.69 S5.2 5.4,40.01 5.4,42.55 6.35,43.5 6.35,49.21 5.4,50.16 S3.2 5.4,50.48 9.21,54.29 9.21,55.88
N$39
  Bottom 0.381: T1.3 66.67,19.68 60.33,13.34 SP1.+
N$41
  Top 0.381: 48.26,17.46 40.64,17.46 38.73,19.37 34.61,19.37 R20.2 | 48.26,17.46 50.8,20 C11.- | 48.26,17.46 51.12,14.61 51.12,11.11 M1.+
N$42
  Top 0.381: R21.1 66.99,29.21 68.9,27.3 68.9,26.04 66.67,23.81 65.41,23.81 T1.2
POT
  Top 0.381: SV4.1 49.53,2.54 49.53,3.81 43.81,9.53 U$14.S
PWRIN
  Top 0.762: J2.1 9.41,6.73 D1.A
R/W
  Top 0.381: SV3.2 94.3,33.34 94.3,40.64 97.16,43.5 DIS1.5
RESET
  Top 0.381: SV9.2 22.23,40.01 19.05,43.18 17.14,43.18 TP6.P$1 | 26.04,28.57 26.04,25.4 27.3,24.13 27.3,21.59 R3.1 | 26.04,28.57 27.94,30.48 S7.2 28.26,30.48 39.05,30.48 43.81,25.72 58.42,25.72 C8.2 | 26.04,28.57 24.13,30.48 21.91,30.48 S7.1
  Bottom 0.381: U4.1 80.01,38.73 67.31,38.73 65.41,36.83 65.41,34.29 63.18,32.07 56.52,32.07 | 56.52,32.07 29.53,32.07 28.26,30.8 S7.2 | 56.52,32.07 56.52,13.65 63.5,6.67 63.5,2.54 SV6.3 | SV9.2 22.23,37.78 23.5,36.51 23.5,32.38 21.91,30.8 S7.1
RS
  Top 0.381: SV3.1 90.81,39.69 97.16,46.04 DIS1.4
RX-I  (via drill 0.61)
  Top 0.381: v18.41,53.34 18.1,53.34 17.14,54.29 R8.1 | v59.05,22.54 v55.56,22.54 | v63.5,31.11 64.14,31.11 66.04,33.02 71.75,33.02 73.03,34.29 73.03,36.83 77.47,41.27 80.01,41.27 U4.2 87.95,49.21 87.95,53.34 93.98,59.37 93.98,78.11 SV5.1
  Bottom 0.381: v18.41,53.34 18.41,42.23 18.1,41.91 18.1,26.04 29.21,14.92 33.02,14.92 40.64,22.54 v55.56,22.54 | v59.05,22.54 59.05,23.18 63.5,27.62 v63.5,31.11
RXD  (via drill 0.61)
  Top 0.381: v51.12,72.39 50.16,71.44 R9.2 | v32.07,71.75 32.07,68.9 36.2,64.77 v36.2,58.1 | v41.91,52.39 41.91,52.7 42.23,53.02 U1.4
  Bottom 0.381: v51.12,72.39 51.12,79.38 50.48,80.01 38.42,80.01 37.78,79.38 37.78,76.83 32.7,71.75 v32.07,71.75 | v41.91,52.39 v36.2,58.1
RXLED
  Top 0.381: U1.17 42.23,50.16 40.32,52.07 37.78,52.07 34.29,55.56 LED4.C
SCK  (via drill 0.61)
  Top 0.381: 65.09,66.36 65.41,66.04 66.67,66.04 66.99,66.36 66.99,71.12 60.33,77.79 SV7.6 | 65.09,66.36 60.96,70.48 R1.1 | v19.68,40.96 17.46,40.96 TP5.P$1 | v39.69,35.24 39.05,35.24 34.61,39.69 25.72,39.69 24.77,38.73 SV9.4 | v65.09,66.04 65.09,66.36 | v60.33,52.07 52.7,44.45 52.7,34.61 53.66,33.66 59.69,33.66 U4.19
  Bottom 0.381: v19.68,40.96 22.54,40.96 24.77,38.73 SV9.4 | U4.19 59.05,33.02 41.91,33.02 v39.69,35.24 | v65.09,66.04 65.09,63.5 60.33,58.74 v60.33,52.07
SS  (via drill 0.61)
  Top 0.381: v57.78,47.94 57.78,41.91 54.29,38.42 54.29,35.88 U4.16 | v57.78,61.28 57.78,64.14 55.88,66.04 55.88,67.31 v57.78,69.22
  Bottom 0.381: v57.78,61.28 v57.78,47.94 | v57.78,69.22 59.05,69.22 67.63,77.79 SV7.3
TX-O  (via drill 0.61)
  Top 0.381: v53.66,69.22 50.16,69.22 R9.1 | v56.83,66.67 56.83,67.31 57.47,67.94 61.59,67.94 64.45,65.09 v68.26,65.09 | U4.3 87.31,51.12 87.31,73.66 91.76,78.11 SV5.2
  Bottom 0.381: v53.66,69.22 54.29,69.22 v56.83,66.67 | v68.26,65.09 78.74,65.09 91.76,78.11 SV5.2
TXD
  Top 0.381: U1.20 44.13,47.31 41.91,45.09 38.1,45.09 30.8,52.39 17.14,52.39 R8.2
TXLED
  Top 0.381: U1.10 38.42,53.98 37.47,54.93 37.47,55.24 34.92,57.78 29.53,57.78 27.62,55.88 LED3.C
USBVCC  (via drill 0.61)
  Top 0.381: v30.48,15.88 30.8,16.19 31.75,16.19 Q1.3 | v23.18,43.81 24.45,45.09 C15.A | U1.15 40.96,49.53 40.64,49.85 36.51,49.85 33.34,53.02 24.13,53.02 21.59,55.56 v19.37,55.56 15.56,55.56 14.29,56.83 14.29,68.9 13.97,68.9 13.34,69.53 C12.1 v13.34,72.07 | v15.88,74.61 15.88,76.83 F1.2
  Bottom 0.381: v30.48,15.88 29.21,15.88 18.73,26.35 18.73,41.59 20.95,43.81 | v23.18,43.81 20.95,43.81 | v13.34,72.07 v15.88,74.61 | 20.95,43.81 19.37,45.4 v19.37,55.56
VIN  (via drill 0.61)
  Top 0.381: D1.C 16.83,9.84 16.83,10.48 20.64,14.29 IC3.3
  Top 0.762: C5.+ 17.77,17.38 IC3.3 20.83,14.1 23.5,11.43 27.43,11.43 v27.56,11.3 | v59.18,5.33 61.47,5.33 62.23,6.1 v65.41,6.1
  Bottom 0.762: v27.56,11.3 33.15,11.3 39.12,5.33 v59.18,5.33 | v65.41,6.1 74.17,6.1 75.82,4.45 75.82,3.05 SV6.8
VUSB
  Top 0.381: 18.73,72.71 C10.1 | 13.34,76.83 F1.1 | 8.9,75.69 U$13.VBUS
  Top 0.508: 8.9,75.69 11.81,75.69 F1.1 | 13.34,76.83 13.34,75.56 16.26,72.64 C10.1